# Altium schematic sheet 最小系统.SchDoc
size A4
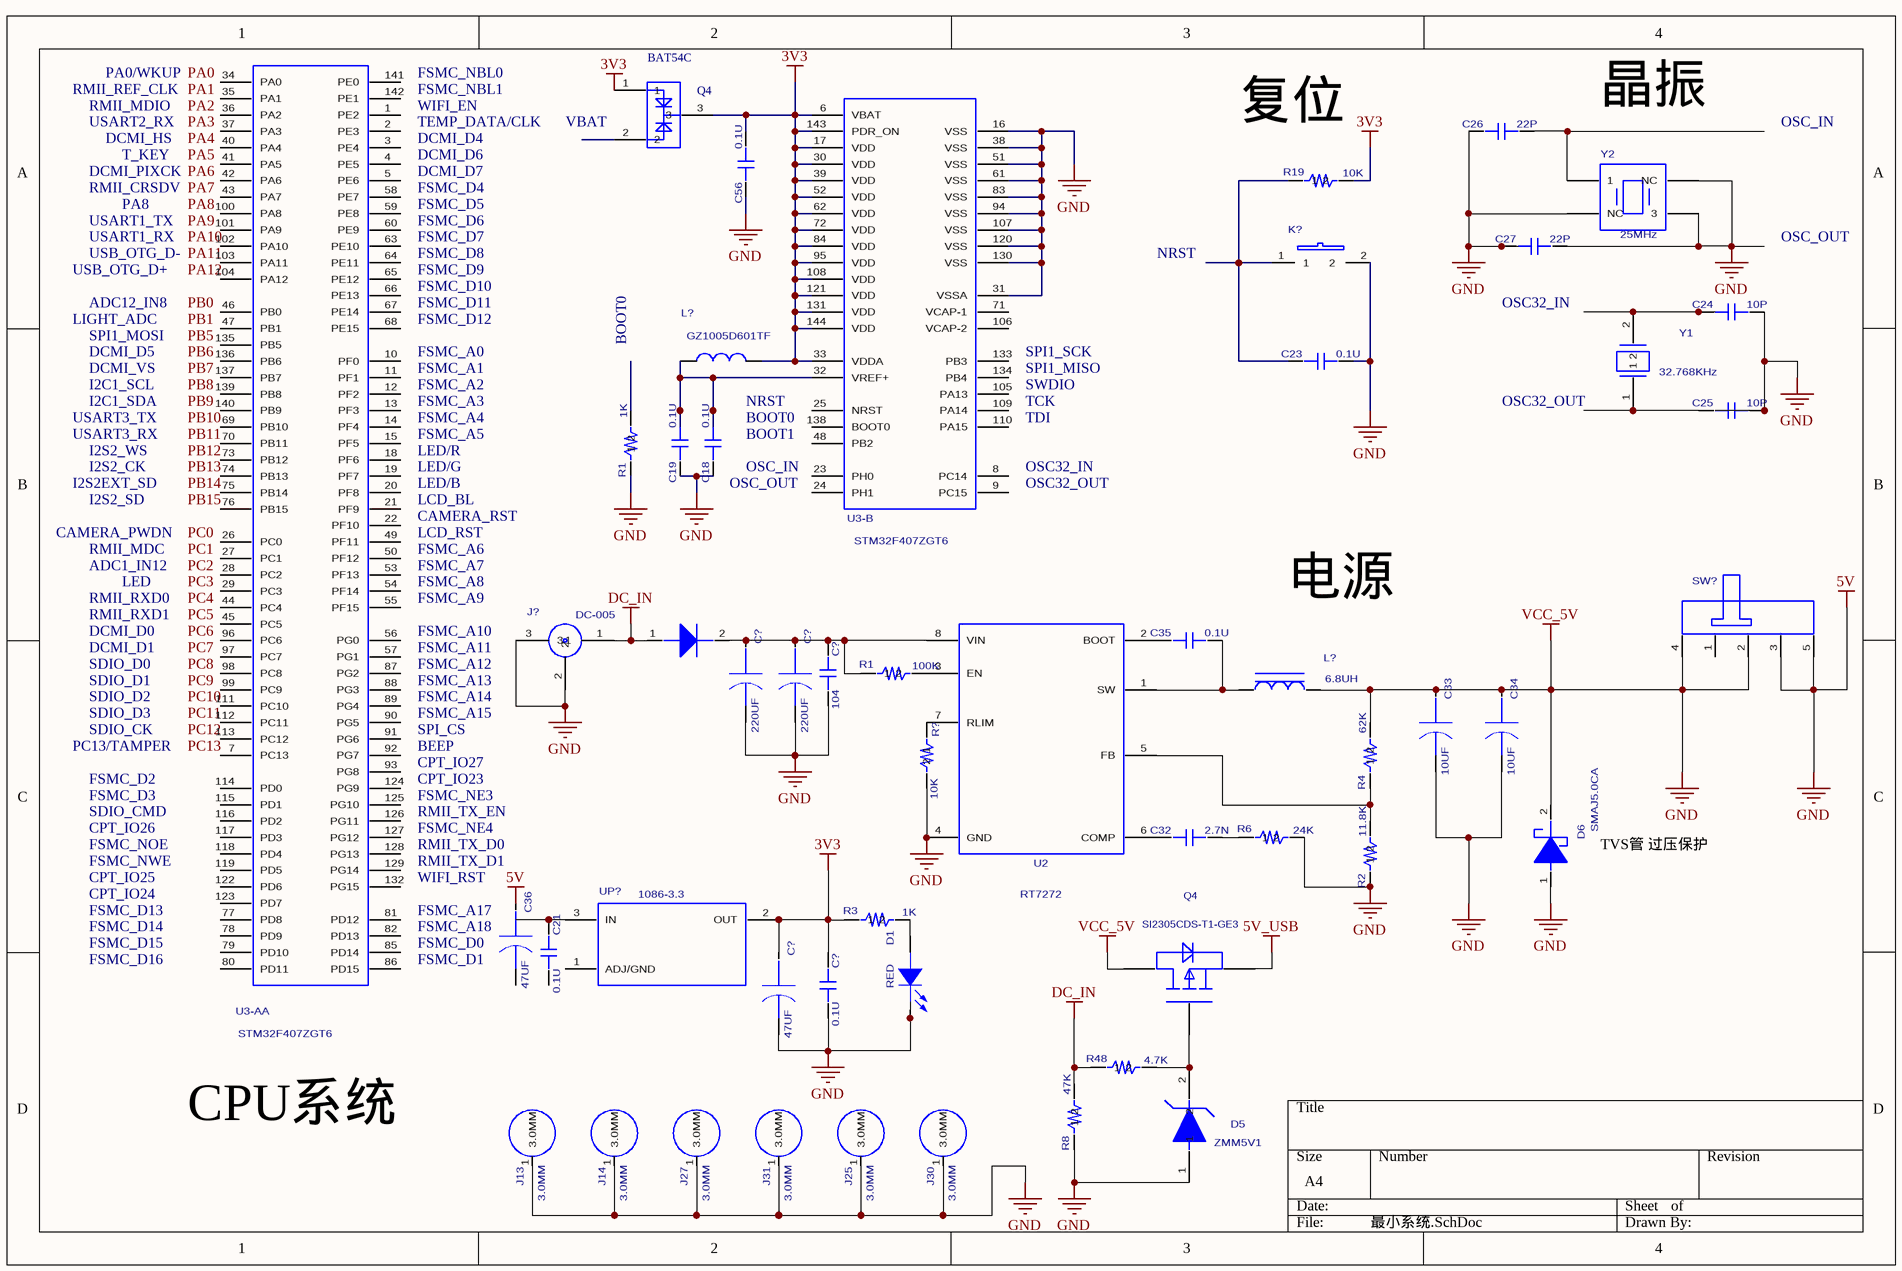
[diagram p0: 最小系统.SchDoc]

## Parts
(Parts that share a designator on the sheet are numbered #1, #2 ... from top to bottom, then left to right.)
C18  value 0.1U  [SC0402]  (hidden comment: C_10P_0402)
C19  value 0.1U  [SC0402]  (hidden comment: C_10P_0402)
C21  value 0.1U  [C_0603]  (hidden comment: C_104_0603)
C23  value 0.1U  [SC0402]  (hidden comment: C_10P_0402)
C24  value 10P  [SC0402]  (hidden comment: C_10P_0402)
C25  value 10P  [SC0402]  (hidden comment: C_10P_0402)
C26  value 22P  [SC0402]  (hidden comment: C_10P_0402)
C27  value 22P  [SC0402]  (hidden comment: C_10P_0402)
C32  value 2.7N  [C_0603]  (hidden comment: C_104_0603)
C33  value 10UF  [EC_220UF_6.5X6.5]  (hidden comment: EC_220UF_6.5X6.5)
C34  value 10UF  [EC_220UF_6.5X6.5]  (hidden comment: EC_220UF_6.5X6.5)
C35  value 0.1U  [C_0603]  (hidden comment: C_104_0603)
C36  value 47UF  [EC_220UF_6.5X6.5]  (hidden comment: EC_220UF_6.5X6.5)
C56  value 0.1U  [SC0402]  (hidden comment: C_10P_0402)
C?#1  value 104  [C_0603]  (hidden comment: C_104_0603)
C?#2  value 220UF  [EC_220UF_6.5X6.5]  (hidden comment: EC_220UF_6.5X6.5)
C?#3  value 220UF  [EC_220UF_6.5X6.5]  (hidden comment: EC_220UF_6.5X6.5)
C?#4  value 0.1U  [C_0603]  (hidden comment: C_104_0603)
C?#5  value 47UF  [EC_220UF_6.5X6.5]  (hidden comment: EC_220UF_6.5X6.5)
D1  value RED  [LED_0603]  (hidden comment: LED_RED_0603)
D5  ZMM5V1  [DIODE_SOP]
D6  SMAJ5.0CA  [DO-214]
D?  SS34  [DO-214]  (value not drawn)
J13  3.0MM  [3.0MM]
J14  3.0MM  [3.0MM]
J25  3.0MM  [3.0MM]
J27  3.0MM  [3.0MM]
J30  3.0MM  [3.0MM]
J31  3.0MM  [3.0MM]
J?  DC-005  [DC-005]
K?  KEY_3X6  [SW3/6-SMD]  (value not drawn)
L?#1  GZ1005D601TF  [SR0402]
L?#2  value 6.8UH  [GDCD4532]  (hidden comment: L_6.8UH_4532)
Q4#1  BAT54C  [SOT-23]  (value not drawn)
Q4#2  value SI2305CDS-T1-GE3  [SOT-23]  (hidden comment: MOSFET_P)
R1#1  value 1K  [SR0402]  (hidden comment: R_1K_0402)
R1#2  value 100K  [R_0603]  (hidden comment: R_10K_0603)
R2  value 11.8K  [R_0603]  (hidden comment: R_10K_0603)
R3  value 1K  [R_0603]  (hidden comment: R_10K_0603)
R4  value 62K  [R_0603]  (hidden comment: R_10K_0603)
R6  value 24K  [R_0603]  (hidden comment: R_10K_0603)
R8  value 47K  [R_0603]  (hidden comment: R_10K_0603)
R19  value 10K  [SR0402]  (hidden comment: R_10K_0402)
R48  value 4.7K  [R_0603]  (hidden comment: R_10K_0603)
R?  value 10K  [R_0603]  (hidden comment: R_10K_0603)
SW?  SW-POWER  [SW13_6]  (value not drawn)
U2  RT7272  [RT7272]
U3-  STM32F407ZGT6  [LC-LQFP-144_20X20X05P]  (part B of 2)
U3-A  STM32F407ZGT6  [LC-LQFP-144_20X20X05P]  (part A of 2)
UP?  1086-3.3  [TO-252-2L]
Y1  value 32.768KHz  [3215]  (hidden comment: XTAL_32.768KHZ)
Y2  value 25MHz  [3225]  (hidden comment: CRYSTAL_8MHZ_3225)

## Nets
3V3: C56.2 C?#4.1 C?#5.1 L?#1.2 Q4#1.1 Q4#1.3 R3.1 R19.2 U3-.6(VBAT) U3-.17(VDD) U3-.30(VDD) U3-.33(VDDA) U3-.39(VDD) U3-.52(VDD) U3-.62(VDD) U3-.72(VDD) U3-.84(VDD) U3-.95(VDD) U3-.108(VDD) U3-.121(VDD) U3-.131(VDD) U3-.143(PDR_ON) U3-.144(VDD) UP?.2(OUT)
5V: C18.1 C19.1 C23.2 C24.2 C25.2 C26.1 C27.1 C27.2 C33.1 C33.2 C34.1 C34.2 C36.1 C56.1 C?#1.2 C?#2.2 C?#3.2 C?#4.2 C?#5.2 D1.K(CATHODE) D5.1 D6.1(+) D6.2(-) J13.1(3.0MM) J14.1(3.0MM) J25.1(3.0MM) J27.1(3.0MM) J30.1(3.0MM) J31.1(3.0MM) J?.2 J?.3 K?.2 L?#2.2 Q4#2.3(D) R1#1.1 R2.1 R4.2 R6.2 R8.1 R?.2 SW?.2 SW?.3 SW?.4 SW?.5 U2.4(GND) U3-.16(VSS) U3-.31(VSSA) U3-.38(VSS) U3-.51(VSS) U3-.61(VSS) U3-.83(VSS) U3-.94(VSS) U3-.107(VSS) U3-.120(VSS) U3-.130(VSS) Y2.2(NC) Y2.3 Y2.4(NC)  [also labelled GND, VCC_5V]
5V_USB: Q4#2.2(S)
DC_IN: D?.1(+) J?.1 R8.2 R48.1
NetC18_2: C18.2 C19.2 L?#1.1 U3-.32(VREF+)
NetC21_1: C21.1 UP?.3(IN)
NetC23_1: C23.1 K?.1 R19.1
NetC24_1: C24.1 Y1.2
NetC25_1: C25.1 Y1.1
NetC26_2: C26.2 Y2.1
NetC32_1: C32.1 U2.6(COMP)
NetC32_2: C32.2 R6.1
NetC35_1: C35.1 U2.2(BOOT)
NetC35_2: C35.2 L?#2.1 U2.1(SW)
NetC?#1_1: C?#1.1 C?#2.1 C?#3.1 D?.2(-) R1#2.1 U2.8(VIN)
NetD1_A: D1.A(ANODE) R3.2
NetD5_2: D5.2 Q4#2.1(G) R48.2
NetR1#2_2: R1#2.2 U2.3(EN)
NetR2_2: R2.2 R4.1 U2.5(FB)
NetR?_1: R?.1 U2.7(RLIM)

Not connected (* = marked no-connect by the designer): C21 2; C36 2; Q4#1 2; R1#1 2; SW? 1; U3- 8(PC14) 9(PC15) 23(PH0) 24(PH1) 25(NRST) 48(PB2) 71(VCAP-1) 105(PA13) 106(VCAP-2) 109(PA14) 110(PA15) 133(PB3) 134(PB4) 138(BOOT0); U3-A 1(PE2) 2(PE3) 3(PE4) 4(PE5) 5(PE6) 7(PC13) 10(PF0) 11(PF1) 12(PF2) 13(PF3) 14(PF4) 15(PF5) 18(PF6) 19(PF7) 20(PF8) 21(PF9) 22(PF10) 26(PC0) 27(PC1) 28(PC2) 29(PC3) 34(PA0) 35(PA1) 36(PA2) 37(PA3) 40(PA4) 41(PA5) 42(PA6) 43(PA7) 44(PC4) 45(PC5) 46(PB0) 47(PB1) 49(PF11) 50(PF12) 53(PF13) 54(PF14) 55(PF15) 56(PG0) 57(PG1) 58(PE7) 59(PE8) 60(PE9) 63(PE10) 64(PE11) 65(PE12) 66(PE13) 67(PE14) 68(PE15) 69(PB10) 70(PB11) 73(PB12) 74(PB13) 75(PB14) 76(PB15) 77(PD8) 78(PD9) 79(PD10) 80(PD11) 81(PD12) 82(PD13) 85(PD14) 86(PD15) 87(PG2) 88(PG3) 89(PG4) 90(PG5) 91(PG6) 92(PG7) 93(PG8) 96(PC6) 97(PC7) 98(PC8) 99(PC9) 100(PA8) 101(PA9) 102(PA10) 103(PA11) 104(PA12) 111(PC10) 112(PC11) 113(PC12) 114(PD0) 115(PD1) 116(PD2) 117(PD3) 118(PD4) 119(PD5) 122(PD6) 123(PD7) 124(PG9) 125(PG10) 126(PG11) 127(PG12) 128(PG13) 129(PG14) 132(PG15) 135(PB5) 136(PB6) 137(PB7) 139(PB8) 140(PB9) 141(PE0) 142(PE1); UP? 1(ADJ/GND)

## Notes on the sheet
- (near Q4#1) BAT54C
- RMII_REF_CLK
- RMII_MDIO
- USART2_RX
- PA0/WKUP
- DCMI_HS
- (near U3-A) FSMC_NBL0
- (near U3-A) FSMC_NBL1
- (near U3-A) WIFI_EN
- (near U3-A) TEMP_DATA/CLK
- (near U3-A) DCMI_D4
- (near Q4#1) VBAT
- (near Q4#1) Q4
- (near R19) 复位
- 晶振
- OSC_IN
- DCMI_PIXCK
- RMII_CRSDV
- USART1_TX
- T_KEY
- PA8
- (near U3-A) DCMI_D6
- (near U3-A) DCMI_D7
- (near U3-A) FSMC_D4
- (near U3-A) FSMC_D5
- (near U3-A) FSMC_D6
- USB_OTG_D+
- USART1_RX
- USB_OTG_D-
- ADC12_IN8
- (near U3-A) FSMC_D7
- (near U3-A) FSMC_D8
- (near U3-A) FSMC_D9
- (near U3-A) FSMC_D10
- (near U3-A) FSMC_D11
- NRST
- OSC32_IN
- OSC_OUT
- LIGHT_ADC
- SPI1_MOSI
- DCMI_D5
- DCMI_VS
- I2C1_SCL
- (near U3-A) FSMC_D12
- (near U3-A) FSMC_A0
- (near U3-A) FSMC_A1
- (near U3-A) FSMC_A2
- BOOT0
- (near U3-) SPI1_SCK
- (near U3-) SPI1_MISO
- (near U3-) SWDIO
- USART3_TX
- USART3_RX
- I2C1_SDA
- I2S2_WS
- I2S2_CK
- (near U3-A) FSMC_A3
- (near U3-A) FSMC_A4
- (near U3-A) FSMC_A5
- (near U3-A) LED/R
- (near U3-A) LED/G
- (near C18) BOOT1
- (near U3-) TCK
- (near U3-) TDI
- (near U3-) OSC32_IN
- OSC32_OUT
- CAMERA_PWDN
- I2S2EXT_SD
- I2S2_SD
- RMII_MDC
- (near U3-A) LED/B
- (near U3-A) LCD_BL
- (near U3-A) CAMERA_RST
- (near U3-A) FSMC_A6
- (near U3-A) LCD_RST
- (near C18) OSC_OUT
- (near U3-) OSC32_OUT
- ADC1_IN12
- RMII_RXD0
- RMII_RXD1
- DCMI_D0
- LED
- (near U3-A) FSMC_A7
- (near U3-A) FSMC_A8
- (near U3-A) FSMC_A9
- FSMC_A10
- 电源
- DCMI_D1
- SDIO_D0
- SDIO_D1
- SDIO_D2
- SDIO_D3
- FSMC_A11
- FSMC_A12
- FSMC_A13
- (near U3-A) FSMC_A15
- (near U3-A) FSMC_A14
- PC13/TAMPER
- SDIO_CK
- FSMC_D2
- FSMC_D3
- (near U3-A) SPI_CS
- (near U3-A) BEEP
- (near U3-A) CPT_IO27
- (near U3-A) CPT_IO23
- (near U3-A) FSMC_NE3
- SDIO_CMD
- CPT_IO26
- FSMC_NOE
- FSMC_NWE
- CPT_IO25
- (near U3-A) RMII_TX_EN
- (near U3-A) FSMC_NE4
- RMII_TX_D0
- RMII_TX_D1
- WIFI_RST
- (near D6) TVS管 过压保护
- CPT_IO24
- FSMC_D13
- FSMC_D14
- FSMC_D15
- FSMC_D16
- FSMC_A17
- FSMC_D0
- FSMC_A18
- FSMC_D1
- CPU系统
- Labels drawn without touching a wire or pin: PA1, PA2, PA3, PA4, PA5, PA6, PA7, PA8, PA9, PA10, PA11, PA12, PB0, PB1, PB5, PB6, PB7, PB8, PB9, PB10, PB11, PB12, PB13, PB14, PB15, PC0, PC1, PC2, PC3, PC4, PC5, PC6, PC7, PC8, PC9, PC10, PC11, PC12, PC13

## Library data of the parts
D6 = SMAJ5.0CA: SMAJ5.0CA-E3/61 400W 5V; Manufacture 1 P/N: SMAJ5.0CA; Value: SMAJ5.0CA; PCB DECAL: DO-214
K? = KEY_3X6: Manufacturer #1 PN: KEY; PCB DECAL: SW3/6-SMD
SW? = SW-POWER: SW-5; Manufacturer #1 PN: SW-5; PCB DECAL: SW13_6
UP? = 1086-3.3: Manufacturer #1: AMS; Manufacturer #1 PN: 1086-3.3; Value: 1086-3.3; PCB DECAL: TO-252-2L
C18 C19 C23-C27 C56 = C_10P_0402: PCB DECAL: SC0402
C21 C32 C35 C?#1 C?#4 = C_104_0603: PCB DECAL: C_0603
C33 C34 C36 C?#2 C?#3 C?#5 = EC_220UF_6.5X6.5: PCB DECAL: EC_220UF_6.5X6.5
D1 = LED_RED_0603: PCB DECAL: LED_0603
D5 = ZMM5V1: Value: ZMM5V1; PCB DECAL: DIODE_SOP
D? = SS34: PCB DECAL: DO-214
J13 J14 J25 J27 J30 J31 = 3.0MM: PCB DECAL: 3.0MM
J? = DC-005: PCB DECAL: DC-005
L?#1 = GZ1005D601TF: Value: GZ1005D601TF; PCB DECAL: SR0402
L?#2 = L_6.8UH_4532: PCB DECAL: GDCD4532
Q4#1 = BAT54C: Value: BAT54C; PCB DECAL: SOT-23
Q4#2 = MOSFET_P: PCB DECAL: SOT-23
R1#1 = R_1K_0402: PCB DECAL: SR0402
R1#2 R2-R4 R6 R8 R48 R? = R_10K_0603: PCB DECAL: R_0603
R19 = R_10K_0402: PCB DECAL: SR0402
U2 = RT7272: PCB DECAL: RT7272; Value: RT7272
U3- U3-A = STM32F407ZGT6: PCB DECAL: LC-LQFP-144_20X20X05P; Value: STM32F407ZG
Y1 = XTAL_32.768KHZ: PCB DECAL: 3215
Y2 = CRYSTAL_8MHZ_3225: PCB DECAL: 3225